# Altium schematic sheet MCISO-S08-V00-Peripherals.SchDoc: Peripherals
size A3; DrawnBy: John Hatfield; SheetNumber: 8; SheetTotal: 8
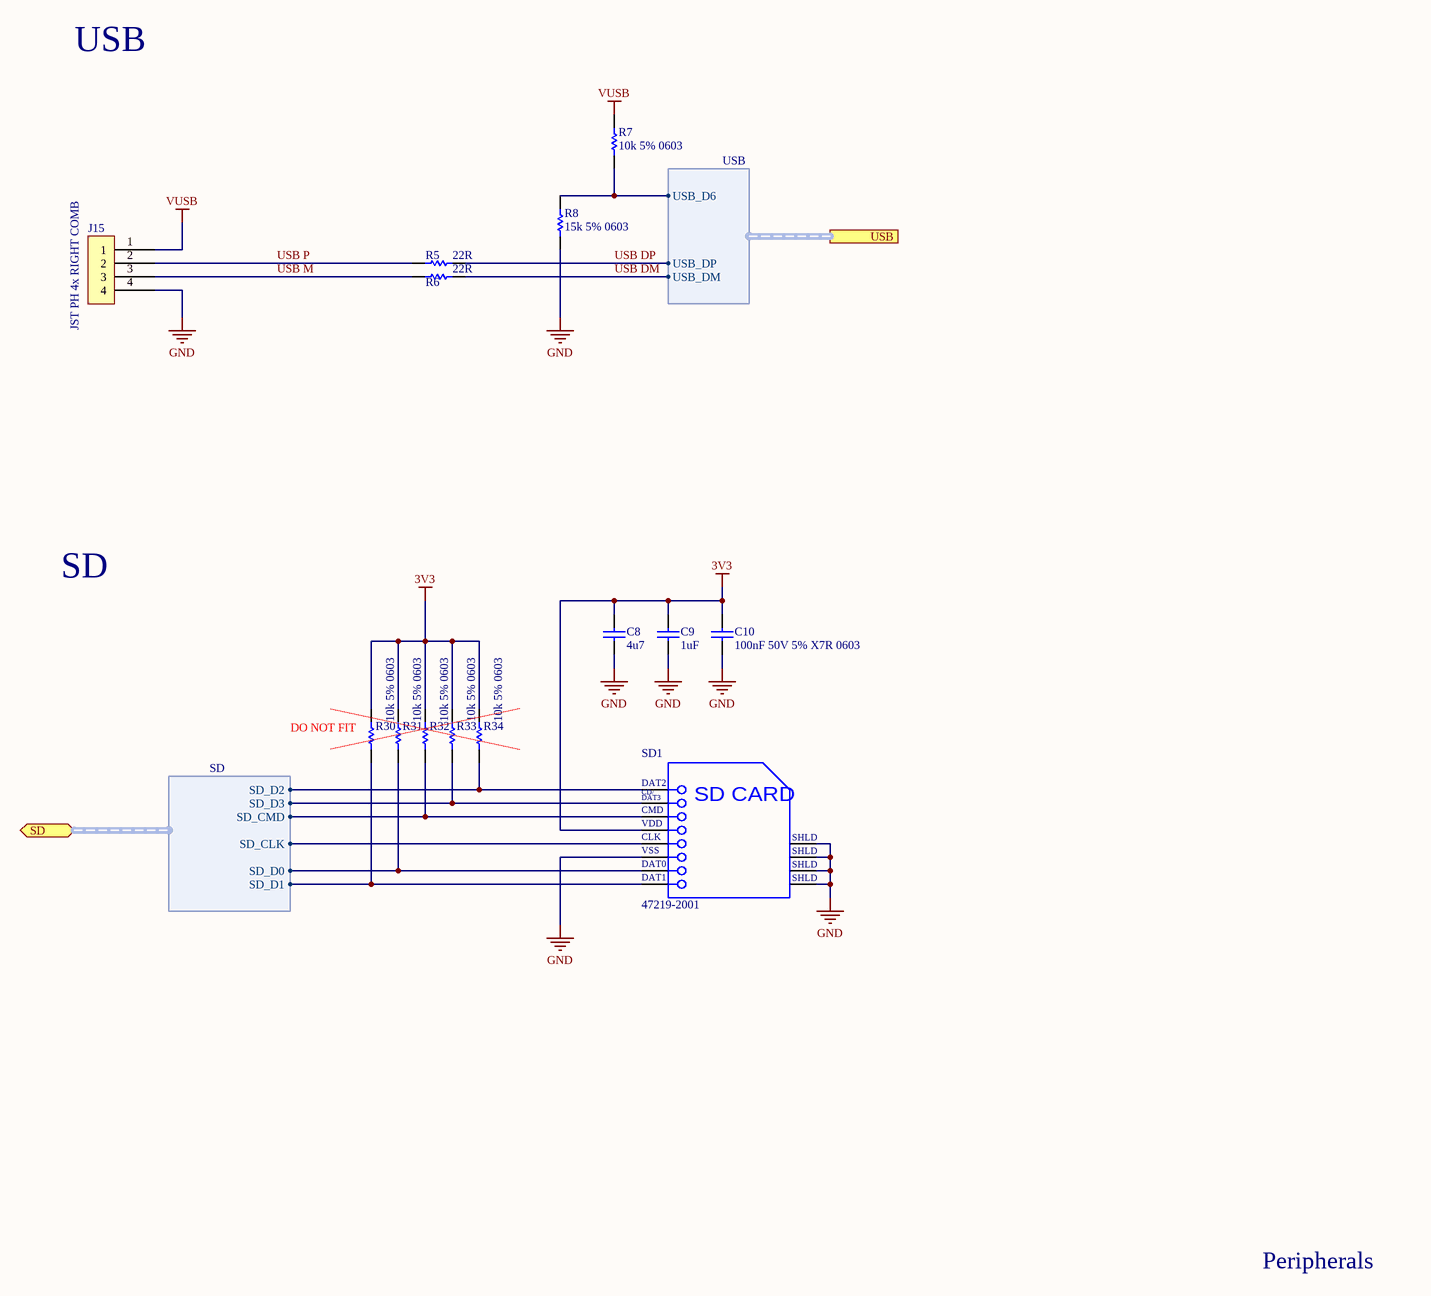
[diagram p0: MCISO-S08-V00-Peripherals.SchDoc]

## Parts
C8  4u7  [Cap_Ceramic_0603]
C9  1uF  [Cap_Ceramic_0603]
C10  100nF 50V 5% X7R 0603  [Cap_Ceramic_0603]
J15  JST PH 4x RIGHT COMB  [JST PH 4x RIGHT COMB]
R5  22R  [Res_ThinFilm_0603]
R6  22R  [Res_ThinFilm_0603]
R7  10k 5% 0603  [Res_ThinFilm_0603]
R8  15k 5% 0603  [Res_ThinFilm_0603]
R30  10k 5% 0603  [Res_ThinFilm_0603]
R31  10k 5% 0603  [Res_ThinFilm_0603]
R32  10k 5% 0603  [Res_ThinFilm_0603]
R33  10k 5% 0603  [Res_ThinFilm_0603]
R34  10k 5% 0603  [Res_ThinFilm_0603]
SD1  47219-2001  [MOLX-47219-2001-8_V]

## Ports
SD (bidir, harness SD), USB (harness USB)

## Harnesses
USB: USB_DP, USB_D6, USB_DM
SD: SD_D2, SD_D3, SD_CMD, SD_CLK, SD_D0, SD_D1

## Nets
3V3: C8.2 C9.2 C10.2 R30.2 R31.2 R32.2 R33.2 R34.2 SD1.4(VDD)
GND: C8.1 C9.1 C10.1 J15.4 R8.1 SD1.6(VSS) SD1.9(SHLD) SD1.10(SHLD) SD1.11(SHLD) SD1.12(SHLD)
VUSB: J15.1 R7.2
USB DM: R6.2 ; port USB.USB_DM
USB DP: R5.2 ; port USB.USB_DP
USB M: J15.3 R6.1
USB P: J15.2 R5.1
NetR7_1: R7.1 R8.2 ; port USB.USB_D6
NetR30_1: R30.1 SD1.8(DAT1) ; port SD.SD_D1
NetR31_1: R31.1 SD1.7(DAT0) ; port SD.SD_D0
NetR32_1: R32.1 SD1.3(CMD) ; port SD.SD_CMD
NetR33_1: R33.1 SD1.2(CD/DAT3) ; port SD.SD_D3
NetR34_1: R34.1 SD1.1(DAT2) ; port SD.SD_D2
NetSD1_5: SD1.5(CLK) ; port SD.SD_CLK

## Notes on the sheet
- USB
- SD
- (near R30) DO NOT FIT
- Peripherals
- (in symbol CMP-2000-05245-1) CD/; DAT3; SD CARD

## Library data of the parts
C8 = 4u7 50V 5% X7R 0603: Capacitor, Ceramic, SMD, 4u7, 50V, 5%, X7R, 0603
C9 = 1uF 25V 5% X7R 0603: Capacitor, Ceramic, SMD, 1uF, 25V, 5%, X7R, 0603
C10 = 100nF 50V 5% X7R 0603: Capacitor, Ceramic, SMD, 100nF, 50V, 5%, X7R, 0603
R5 R6 = 22R 1% 0603: Resistor, SMD, 22R, 0.1W, 1%, 0603
R7 R30-R34 = 10k 5% 0603: Resistor, SMD, 10k, 0.1W, 5%, 0603
R8 = 15k 5% 0603: Resistor, SMD, 15k, 0.1W, 5%, 0603
SD1 = CMP-2000-05245-1: MicroSD Card Connector, Hinge Type, -40 to 85 degC, 8-Pin SMD, RoHS, Tape and Reel; Manufacturer: Molex; Current Rating: 500mA; Number of Contacts: 8; Pitch: 1.09mm; Insertion - Extraction Style: Hinged; Voltage Rating: 100VDC; Product: CardConnectors; Contact Material: CopperAlloy; Series: 47219; Packaging: Reel; Brand: Molex; Product Category: MemoryCardConnectors; Housing Material: Thermoplastic; Mounting Style: SMD/SMT; Termination Style: SMD; Datasheet Version: Rev. F, 06/2009; Card Type: microSD; Manufacturer URL: http://www.molex.com/; RoHS: Details; Datasheet URL: http://www.molex.com/pdm_docs/sd/472192001_sd.pdf; Factory Pack Quantity: 2400